# EAGLE design atx4vc (EAGLE 9.6.1)
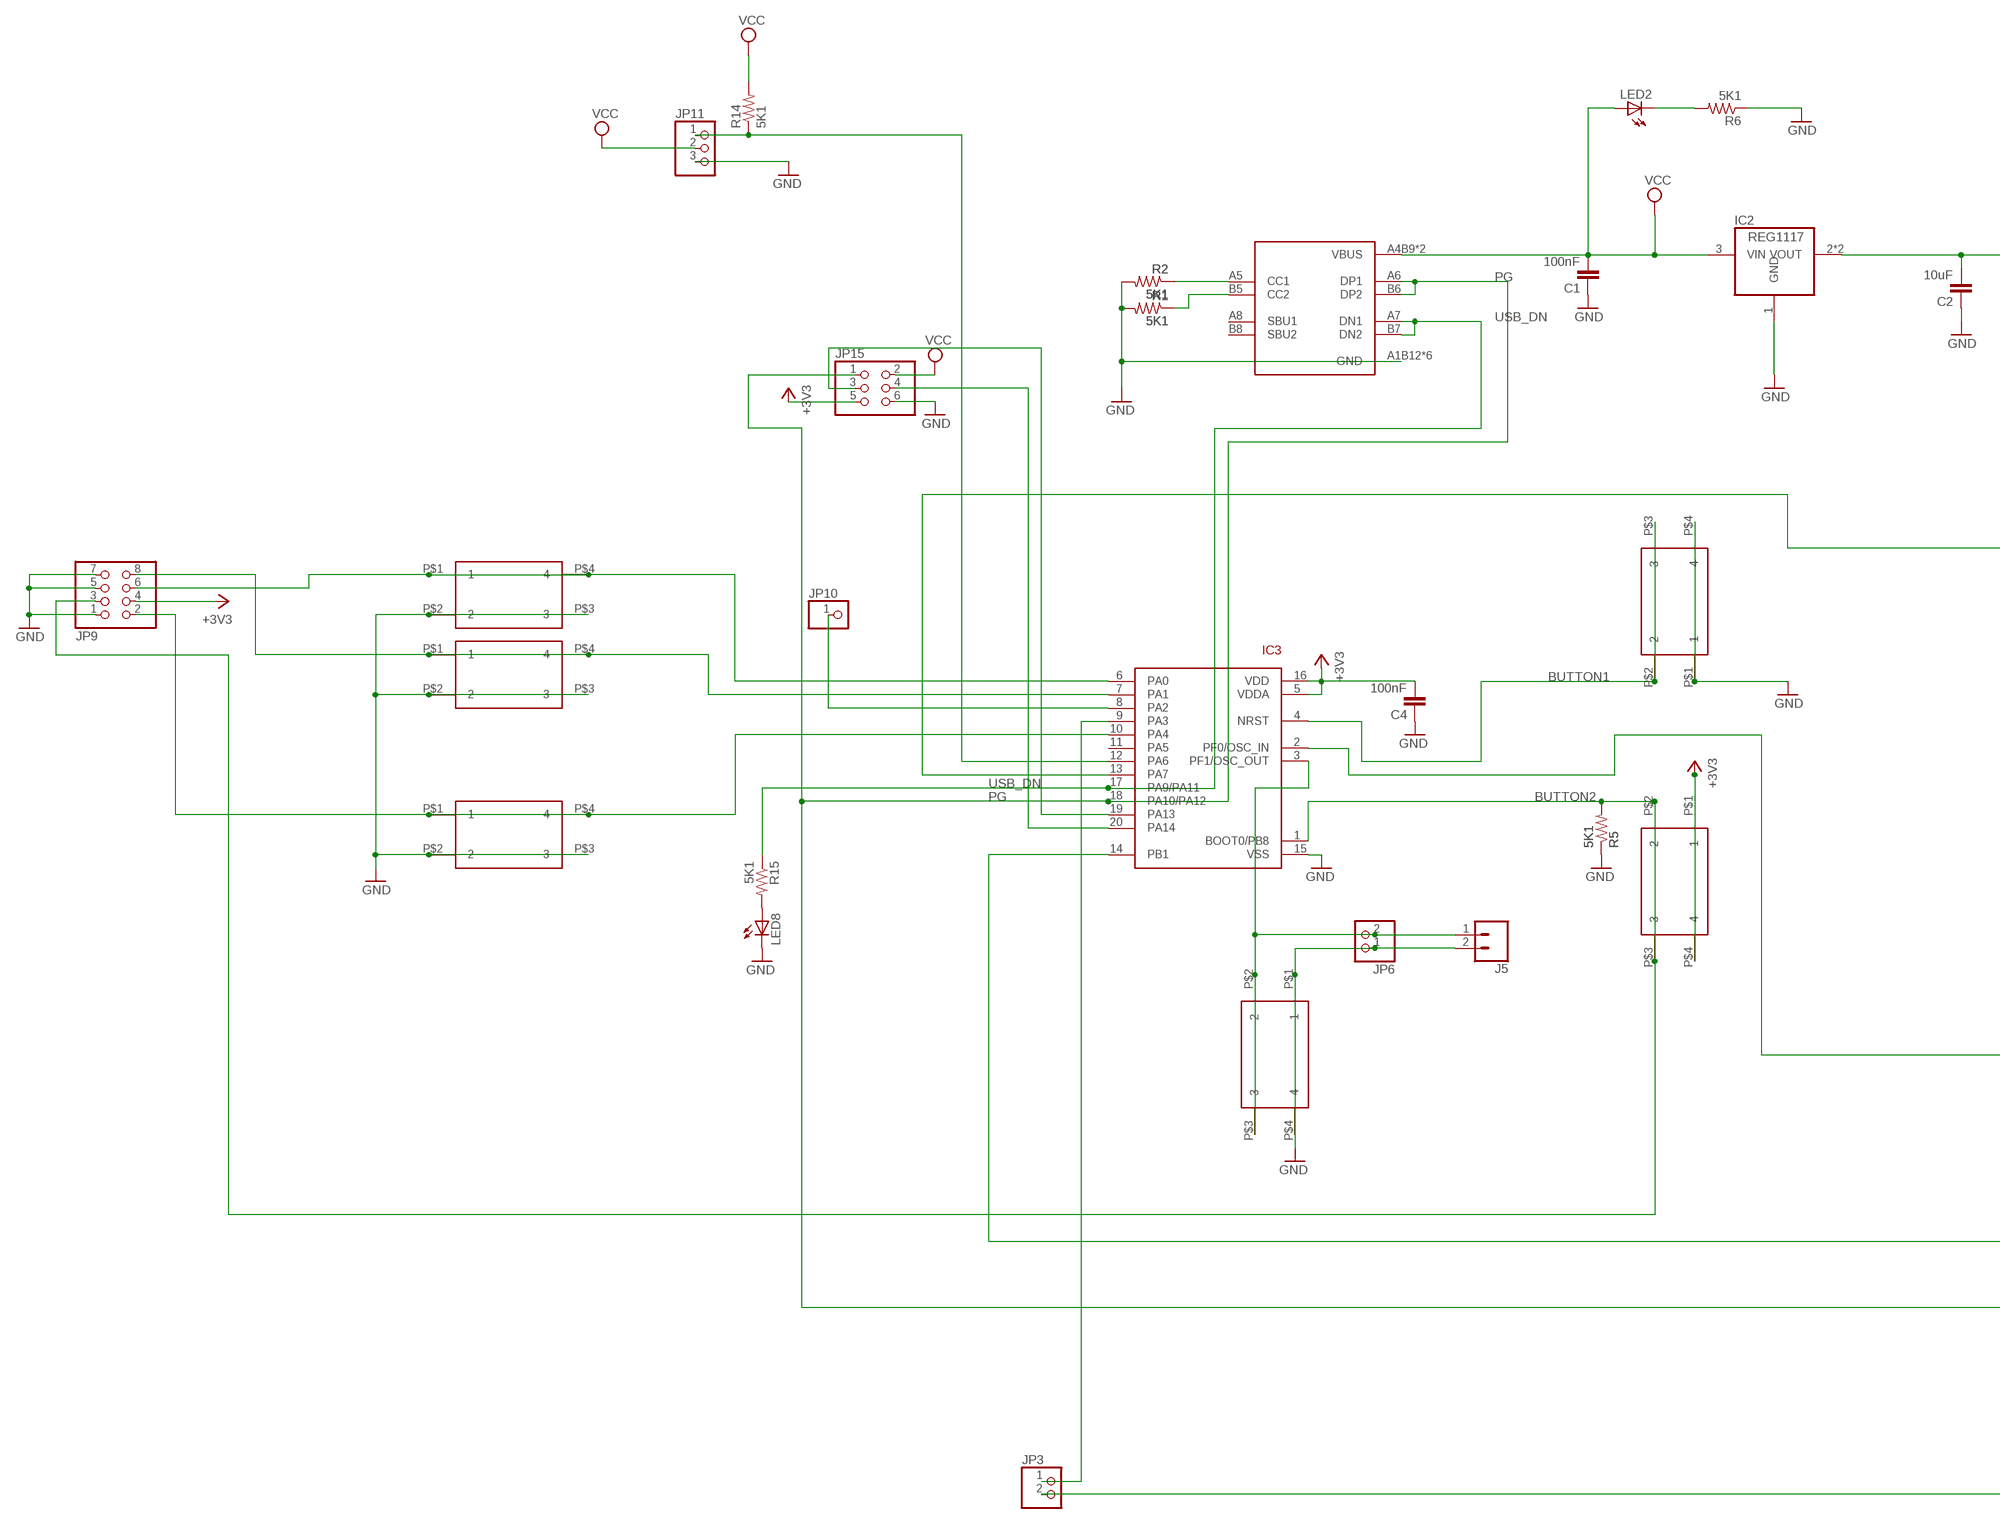
[diagram p0: schematic, sheet 1, part 1 of 2]
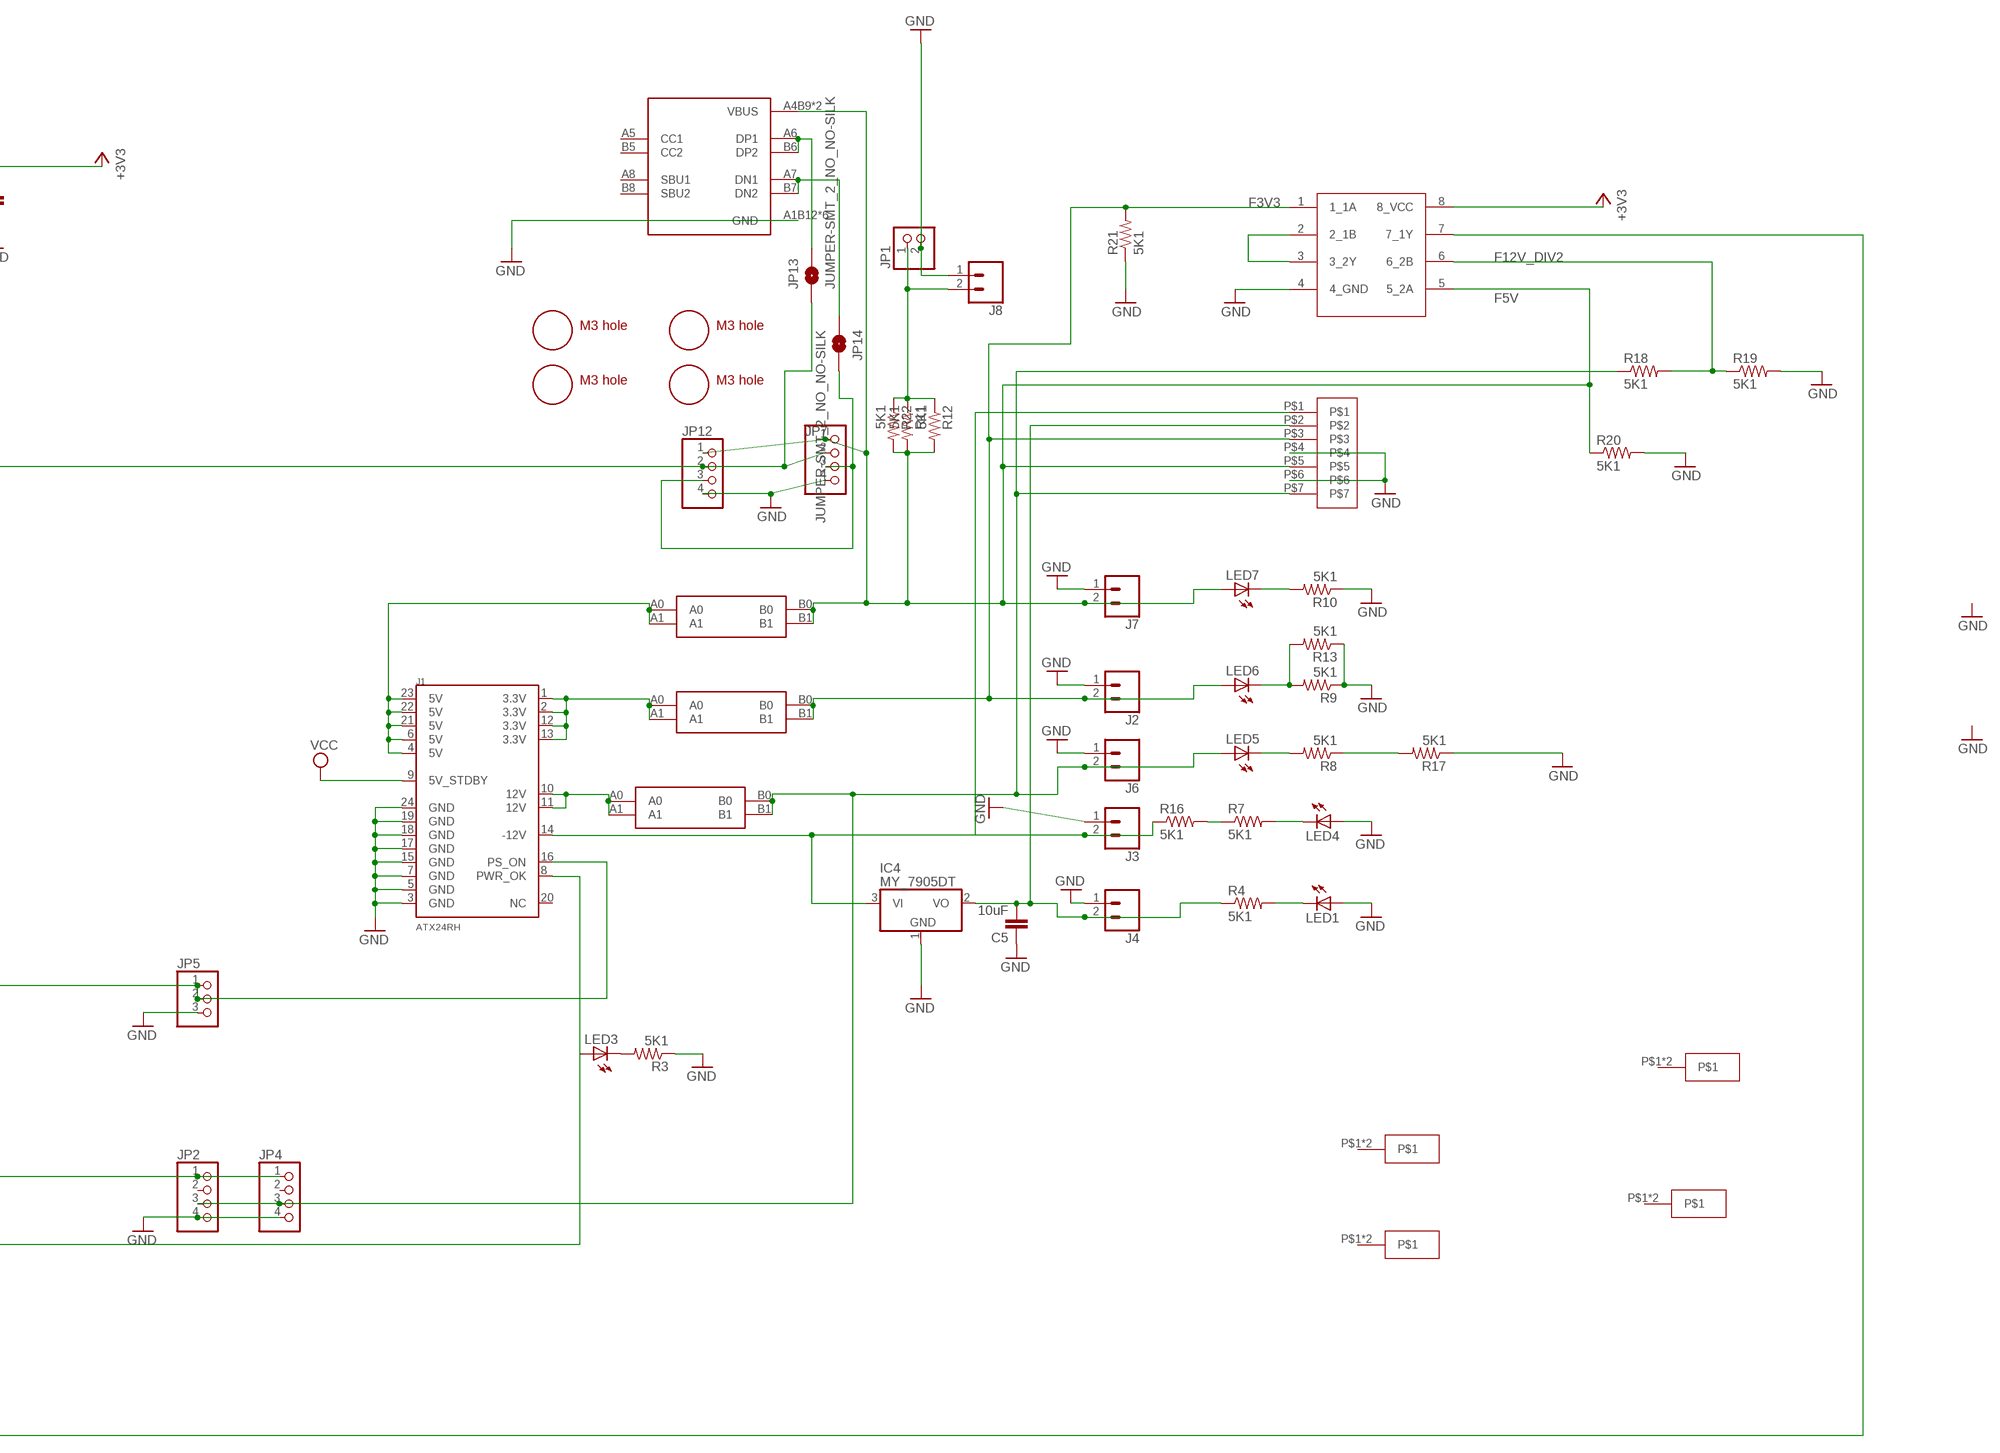
[diagram p1: schematic, sheet 1, part 2 of 2]

## Parts
C1  100nF  CAP0805  [0805$1]
C2  10uF  CAP0805  [0805$1]
C4  100nF  CAP0805  [0805$1]
C5  10uF  CAP0805  [0805$1]
IC2  REG1117  [SOT223]
IC3  STM32F042F4  [TSSOP20]
IC4  MY_7905DT  [ADAFRUIT_TO252]
J1  ATX24RH  [ATX24_RIGHT_ANGLE]
J2  CONN_023.5MM  [SCREWTERMINAL-3.5MM-2]
J3  CONN_023.5MM  [SCREWTERMINAL-3.5MM-2]
J4  CONN_023.5MM  [SCREWTERMINAL-3.5MM-2]
J5  CONN_023.5MM  [SCREWTERMINAL-3.5MM-2]
J6  CONN_023.5MM  [SCREWTERMINAL-3.5MM-2]
J7  CONN_023.5MM-NO_SILK  [SCREWTERMINAL-3.5MM-2-NS]
J8  CONN_023.5MM  [SCREWTERMINAL-3.5MM-2]
JP1  PINHD-1X2  [1X02]
JP2  PINHD-1X4  [1X04]
JP3  PINHD-1X2  [1X02]
JP4  PINHD-1X4  [1X04]
JP5  PINHD-1X3:1  [1X03]
JP6  PINHD-1X2  [1X02]
JP7  PINHD-1X6  [1X06]
JP9  PINHD-2X4  [2X04]
JP10  PINHD-1X1CB  [1X01-CLEANBIG]
JP11  PINHD-1X3CB  [1X03-CLEANBIG]
JP12  PINHD-1X6  [1X06]
JP13  JUMPER-SMT_2_NO_NO-SILK  [SMT-JUMPER_2_NO_NO-SILK]
JP14  JUMPER-SMT_2_NO_NO-SILK  [SMT-JUMPER_2_NO_NO-SILK]
JP15  PINHD-2X3  [2X03]
LED1  LEDCHIP-LED0805  [CHIP-LED0805]
LED2  LEDCHIP-LED0805  [CHIP-LED0805]
LED3  LEDCHIP-LED0805  [CHIP-LED0805]
LED4  LEDCHIP-LED0805  [CHIP-LED0805]
LED5  LEDCHIP-LED0805  [CHIP-LED0805]
LED6  LEDCHIP-LED0805  [CHIP-LED0805]
LED7  LEDCHIP-LED0805  [CHIP-LED0805]
LED8  LEDCHIP-LED0805  [CHIP-LED0805]
R1  5K1  RESISTOR0805-RES  [0805]
R2  5K1  RESISTOR0805-RES  [0805]
R3  5K1  RESISTOR0805-RES  [0805]
R4  5K1  RESISTOR0805-RES  [0805]
R5  5K1  RESISTOR0805-RES  [0805]
R6  5K1  RESISTOR0805-RES  [0805]
R7  5K1  RESISTOR0805-RES  [0805]
R8  5K1  RESISTOR0805-RES  [0805]
R9  5K1  RESISTOR0805-RES  [0805]
R10  5K1  RESISTOR0805-RES  [0805]
R11  5K1  RESISTOR0805-RES  [0805]
R12  5K1  RESISTOR0805-RES  [0805]
R13  5K1  RESISTOR0805-RES  [0805]
R14  5K1  RESISTOR0805-RES  [0805]
R15  5K1  RESISTOR0805-RES  [0805]
R16  5K1  RESISTOR0805-RES  [0805]
R17  5K1  RESISTOR0805-RES  [0805]
R18  5K1  RESISTOR0805-RES  [0805]
R19  5K1  RESISTOR0805-RES  [0805]
R20  5K1  RESISTOR0805-RES  [0805]
R21  5K1  RESISTOR0805-RES  [0805]
R22  5K1  RESISTOR0805-RES  [0805]
SW1  324_SW  [342_SWICH_FOOT]
SW2  324_SW  [342_SWICH_FOOT]
SW3  324_SW  [342_SWICH_FOOT]
SW4  324_SW  [342_SWICH_FOOT]
SW5  324_SW  [342_SWICH_FOOT]
SW7  324_SW  [342_SWICH_FOOT]
U1  USBC_16P  [USBC_16P_FOOT]
U2  USBC_16P  [USBC_16P_FOOT]
U$1  M3_MOUNTING_HOLE  [M3_MOUNTING_HOLE_PACK]
U$2  M3_MOUNTING_HOLE  [M3_MOUNTING_HOLE_PACK]
U$3  M3_MOUNTING_HOLE  [M3_MOUNTING_HOLE_PACK]
U$4  VH396  [396_7P]
U$5  CAR_FUSE_HOLDER3IN1  [FUSE_HOLDER_3IN1]
U$6  74LVC2G08  [VSSOP08]
U$7  CAR_FUSE_HOLDER3IN1  [FUSE_HOLDER_3IN1]
U$8  CAR_FUSE_HOLDER3IN1  [FUSE_HOLDER_3IN1]
U$9  WAGO257  [WAGL257]
U$10  M3_MOUNTING_HOLE  [M3_MOUNTING_HOLE_PACK]
U$11  WAGO257  [WAGL257]
U$12  WAGO257  [WAGL257]
U$13  WAGO257  [WAGL257]

## Nets
+3V3: C2.2 C4.2 IC2.2(VOUT) IC2.4(VOUT) IC3.5(VDDA) IC3.16(VDD) JP9.4 JP15.5 SW4.P$1 SW4.P$4 U$6.8(8_VCC)
BUTTON1: IC3.4(NRST) SW3.P$2 SW3.P$3
BUTTON2: IC3.1(BOOT0/PB8) JP9.3 R5.2 SW4.P$2 SW4.P$3
F3V3: J2.2 LED6.A R21.2 U$4.P$3 U$6.1(1_1A) U$7.B0 U$7.B1
F5V: J7.2 JP7.1 JP12.1 LED7.A R11.2 R12.2 R20.1 R22.2 U1.A4B9(VBUS) U1.B4A9(VBUS) U$4.P$5 U$6.5(5_2A) U$8.B0 U$8.B1
F12V: J6.2 JP2.3 JP4.3 LED5.A R18.1 U$4.P$7 U$5.B0 U$5.B1
F12V_DIV2: R18.2 R19.1 U$6.6(6_2B)
GND: C1.1 C2.1 C4.1 C5.1 IC2.1(GND) IC3.15(VSS) IC4.1(GND) J1.3(GND) J1.5(GND) J1.7(GND) J1.15(GND) J1.17(GND) J1.18(GND) J1.19(GND) J1.24(GND) J2.1 J3.1 J4.1 J5.2 J6.1 J7.1 J8.1 JP1.2 JP2.4 JP4.4 JP5.3 JP6.1 JP7.4 JP9.1 JP9.5 JP9.7 JP11.3 JP12.4 JP15.6 LED1.A LED4.A LED8.C R1.2 R2.2 R3.1 R5.1 R6.1 R9.1 R10.1 R13.1 R17.1 R19.2 R20.2 R21.1 SW1.P$1 SW1.P$4 SW2.P$2 SW2.P$3 SW3.P$1 SW3.P$4 SW5.P$2 SW5.P$3 SW7.P$2 SW7.P$3 U1.A1B12(GND) U1.B11A12(GND) U1.P$13(GND) U1.P$14(GND) U1.P$15(GND) U1.P$16(GND) U2.A1B12(GND) U2.B11A12(GND) U2.P$13(GND) U2.P$14(GND) U2.P$15(GND) U2.P$16(GND) U$4.P$4 U$4.P$6 U$6.4(4_GND)
N$1: LED3.C R3.2
N$2: IC4.3(VI) J1.14(-12V) J3.2 R16.1 U$4.P$1
N$3: IC3.20(PA14) JP15.4
N$4: IC3.19(PA13) JP15.3
N$5: LED1.C R4.2
N$6: IC3.12(PA6) JP11.1 R14.1
N$7: IC3.14(PB1) JP2.1 JP4.1
N$8: LED4.C R7.2
N$9: LED5.C R8.2
N$10: J1.4(5V) J1.6(5V) J1.21(5V) J1.22(5V) J1.23(5V) U$8.A0 U$8.A1
N$11: C5.2 IC4.2(VO) J4.2 R4.1 U$4.P$2
N$12: U$6.2(2_1B) U$6.3(3_2Y)
N$13: IC3.6(PA0) JP9.6 SW2.P$1 SW2.P$4
N$14: J1.1(3.3V) J1.2(3.3V) J1.12(3.3V) J1.13(3.3V) U$7.A0 U$7.A1
N$17: J8.2 JP1.1 R11.1 R12.1 R22.1
N$18: LED6.C R9.2 R13.2
N$19: LED8.A R15.2
N$20: LED7.C R10.2
N$21: J1.10(12V) J1.11(12V) U$5.A0 U$5.A1
N$22: IC3.7(PA1) JP9.8 SW5.P$1 SW5.P$4
N$23: IC3.8(PA2) JP10.1
N$24: JP3.2 U$6.7(7_1Y)
N$25: IC3.2(PF0/OSC_IN) J1.16(PS_ON) JP5.1 JP5.2
N$26: IC3.3(PF1/OSC_OUT) J5.1 JP6.2 SW1.P$2 SW1.P$3
N$27: IC3.10(PA4) JP9.2 SW7.P$1 SW7.P$4
N$28: R7.1 R16.2
N$29: LED2.C R6.2
N$31: R1.1 U2.B5(CC2)
N$32: R8.1 R17.2
N$33: R2.1 U2.A5(CC1)
N$34: JP13.2 U1.A6(DP1) U1.B6(DP2)
N$35: IC3.13(PA7) JP7.2 JP12.2 JP13.1
N$36: JP14.1 U1.A7(DN1) U1.B7(DN2)
N$37: JP7.3 JP12.3 JP14.2
N$38: IC3.9(PA3) JP3.1
PG: IC3.18(PA10/PA12) J1.8(PWR_OK) JP15.1 LED3.A U2.A6(DP1) U2.B6(DP2)
USB_DN: IC3.17(PA9/PA11) R15.1 U2.A7(DN1) U2.B7(DN2)
VCC: C1.2 IC2.3(VIN) J1.9(5V_STDBY) JP11.2 JP15.2 LED2.A R14.2 U2.A4B9(VBUS) U2.B4A9(VBUS)
Unconnected: IC3.11(PA5) J1.20(NC) JP2.2 JP4.2 U1.A5(CC1) U1.A8(SBU1) U1.B5(CC2) U1.B8(SBU2) U2.A8(SBU1) U2.B8(SBU2) U$9.P$1 U$9.P$2 U$11.P$1 U$11.P$2 U$12.P$1 U$12.P$2 U$13.P$1 U$13.P$2

## Library data of the parts
C1 C2 C4 C5 = atx_power_control:CAP: Capacitor Standard 0603 ceramic capacitor, and 0.1" leaded capacitor.
IC2 = atx_power_control:REG1117: 800mA and 1A Low Dropout (LDO) Positive Regulator 1.8V, 2.5V, 2.85V, 3.3V, 5V, and Adj; MF: TEXAS INSTRUMENTS; MPN: REG1117FAKTTT; OC_FARNELL: 1296120; OC_NEWARK: 87H2562
IC3 = tx:STM32F042F4
IC4 = atx_power_control:MY_7905: Positive VOLTAGE REGULATOR Added bigger pads to the TO-92 package
J1 = SparkFun-Connectors:ATX24: ATX24 Pin Power Supply Connector This is a good connector for connecting a computer power supply to a PCB. It's massive, but provides many amps of power at 5V and 12V. SKU: PRT-09498
J2-J6 J8 = atx_power_control:CONN_02: Multi connection point. Often used as Generic Header-pin footprint for 0.1 inch spaced/style header connections On any of the 0.1 inch spaced packages, you can populate with these: Break Away Headers - Straight <https://www.sparkfun.com/products/116> (PRT-00116) Break Away Male Headers - Right Angle <https://www.sparkfun.com/products/553> (PRT-00553) Female Headers <https://www.sparkfun.com/products/115> (PRT-00115) Break Away Headers - Machine Pin <https://www.sparkfun.com/products/117> (PRT-00117) Break Away Female Headers - Swiss Machine Pin <https://www.sparkfun.com/products/743> (PRT-00743) For SCREWTERMINALS and SPRING TERMINALS visit here: Screw Terimnals on SparkFun.com <https://www.sparkfun.com/search/results?term=Screw+Terminals> (5mm/3.5mm/2.54mm spacing) This device is also useful as a general connection point to wire up your design to another part of your project. Our various solder wires solder well into these plated through hole pads. Hook-Up Wire - Assortment (Stranded, 22 AWG) <https://www.sparkfun.com/products/11375> (PRT-11375) Hook-Up Wire - Assortment (Solid Core, 22 AWG) <https://www.sparkfun.com/products/11367> (PRT-11367) View the entire wire category on our website here <https://www.sparkfun.com/categories/141> Special notes: Molex polarized connector foot print use with: PRT-08233 with associated crimp pins and housings. 2.54_SCREWTERM for use with PRT-10571. 3.5mm Screw Terminal footprints for PRT-08084 5mm Screw Terminal footprints for use with PRT-08432; PROD_ID: CONN-08399
J7 = atx_power_control:CONN_02: Multi connection point. Often used as Generic Header-pin footprint for 0.1 inch spaced/style header connections On any of the 0.1 inch spaced packages, you can populate with these: Break Away Headers - Straight <https://www.sparkfun.com/products/116> (PRT-00116) Break Away Male Headers - Right Angle <https://www.sparkfun.com/products/553> (PRT-00553) Female Headers <https://www.sparkfun.com/products/115> (PRT-00115) Break Away Headers - Machine Pin <https://www.sparkfun.com/products/117> (PRT-00117) Break Away Female Headers - Swiss Machine Pin <https://www.sparkfun.com/products/743> (PRT-00743) For SCREWTERMINALS and SPRING TERMINALS visit here: Screw Terimnals on SparkFun.com <https://www.sparkfun.com/search/results?term=Screw+Terminals> (5mm/3.5mm/2.54mm spacing) This device is also useful as a general connection point to wire up your design to another part of your project. Our various solder wires solder well into these plated through hole pads. Hook-Up Wire - Assortment (Stranded, 22 AWG) <https://www.sparkfun.com/products/11375> (PRT-11375) Hook-Up Wire - Assortment (Solid Core, 22 AWG) <https://www.sparkfun.com/products/11367> (PRT-11367) View the entire wire category on our website here <https://www.sparkfun.com/categories/141> Special notes: Molex polarized connector foot print use with: PRT-08233 with associated crimp pins and housings. 2.54_SCREWTERM for use with PRT-10571. 3.5mm Screw Terminal footprints for PRT-08084 5mm Screw Terminal footprints for use with PRT-08432; PROD_ID: CONN-13512; SF_ID: PRT-09918; SF_SKU: PRT-08432; SKU: PRT-09914
JP1 JP3 = pinhead:PINHD-1X2: PIN HEADER
JP2 JP4 = atx_power_control:PINHD-1X4: PIN HEADER
JP5 = atx_power_control:PINHD-1X3*?:1: PIN HEADER
JP6 = atx_power_control:PINHD-1X2: PIN HEADER
JP7 JP12 = atx_power_control:PINHD-1X6: PIN HEADER
JP9 = atx_power_control:PINHD-2X4: PIN HEADER
JP10 = adafruit:PINHD-1X1: Pin header 1x1 for 0.1" spacing With round pins
JP11 = atx_power_control:PINHD-1X3: PIN HEADER
JP13 JP14 = SparkFun-Jumpers:JUMPER-SMT_2_NO: Normally open jumper This jumper has two pads in close proximity to each other. Apply solder to close the connection. Round pads are easier to solder for beginners, but are a lot larger. SparkFun Product that uses the round pads: SparkFun EL Sequencer <https://www.sparkfun.com/products/12781>
JP15 = pinhead:PINHD-2X3: PIN HEADER
LED1-LED8 = adafruit:LED: LED OSRAM: - CHIPLED LG R971, LG N971, LY N971, LG Q971, LY Q971, LO R971, LY R971 LH N974, LH R974 LS Q976, LO Q976, LY Q976 LO Q996 - Hyper CHIPLED LW Q18S LB Q993, LB Q99A, LB R99A - SideLED LS A670, LO A670, LY A670, LG A670, LP A670 LB A673, LV A673, LT A673, LW A673 LH A674 LY A675 LS A676, LA A676, LO A676, LY A676, LW A676 LS A679, LY A679, LG A679 - Hyper Micro SIDELED® LS Y876, LA Y876, LO Y876, LY Y876 LT Y87S - SmartLED LW L88C, LW L88S LB L89C, LB L89S, LG L890 LS L89K, LO L89K, LY L89K LS L896, LA L896, LO L896, LY L896 - TOPLED LS T670, LO T670, LY T670, LG T670, LP T670 LSG T670, LSP T670, LSY T670, LOP T670, LYG T670 LG T671, LOG T671, LSG T671 LB T673, LV T673, LT T673, LW T673 LH T674 LS T676, LA T676, LO T676, LY T676, LB T676, LH T676, LSB T676, LW T676 LB T67C, LV T67C, LT T67C, LS T67K, LO T67K, LY T67K, LW E67C LS E67B, LA E67B, LO E67B, LY E67B, LB E67C, LV E67C, LT E67C LW T67C LS T679, LY T679, LG T679 LS T770, LO T770, LY T770, LG T770, LP T770 LB T773, LV T773, LT T773, LW T773 LH T774 LS E675, LA E675, LY E675, LS T675 LS T776, LA T776, LO T776, LY T776, LB T776 LHGB T686 LT T68C, LB T68C - Hyper Mini TOPLED® LB M676 - Mini TOPLED Santana® LG M470 LS M47K, LO M47K, LY M47K Source: http://www.osram.convergy.de/
R1-R3 R5 R6 R8-R15 R17-R22 = atx_power_control:RESISTOR: Resistor Basic schematic elements and footprints for 0603, 1206, and PTH resistors.
R4 R7 R16 = SparkFun-Passives:RESISTOR: Resistor Basic schematic elements and footprints for 0603, 1206, and PTH resistors.
SW1-SW5 SW7 = 3pos_slide_switch_centered:324_SW
U1 U2 = my_usbc_16p:USBC_16P
U$1-U$3 U$10 = a:M3_MOUNTING_HOLE
U$4 = 396_conn:VH396
U$5 U$7 U$8 = atx_power_control:CAR_FUSE_HOLDER
U$6 = atx4vc:74LVC2G08
U$9 U$11-U$13 = atx4vc:WAGO257

## Board
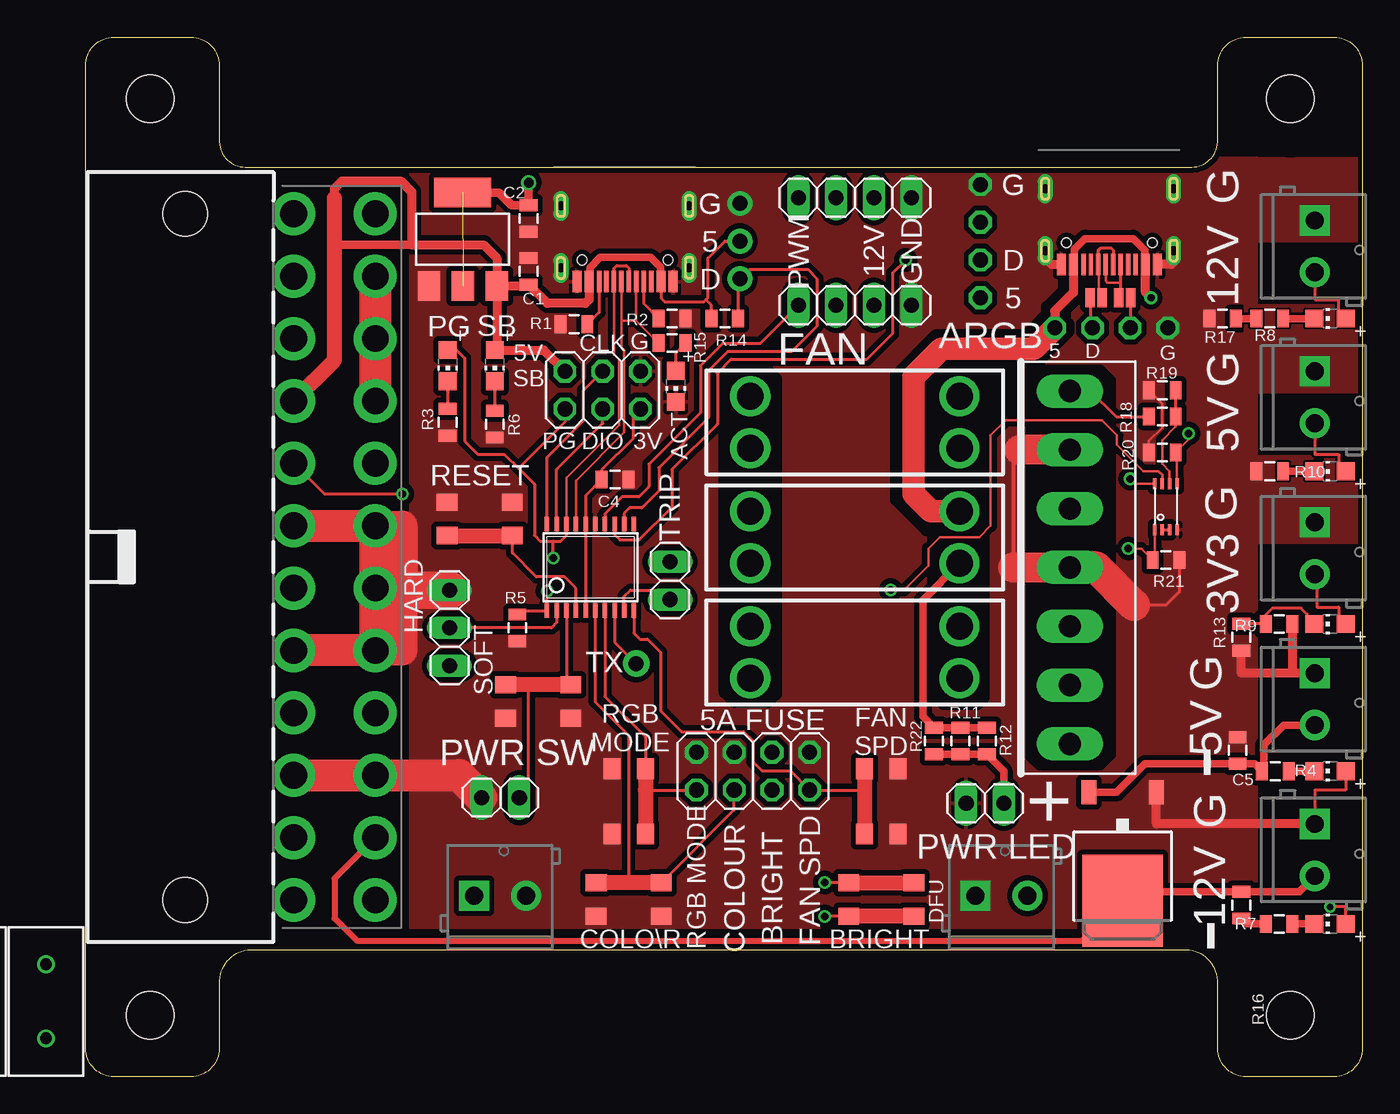
[diagram p2: board, top side]
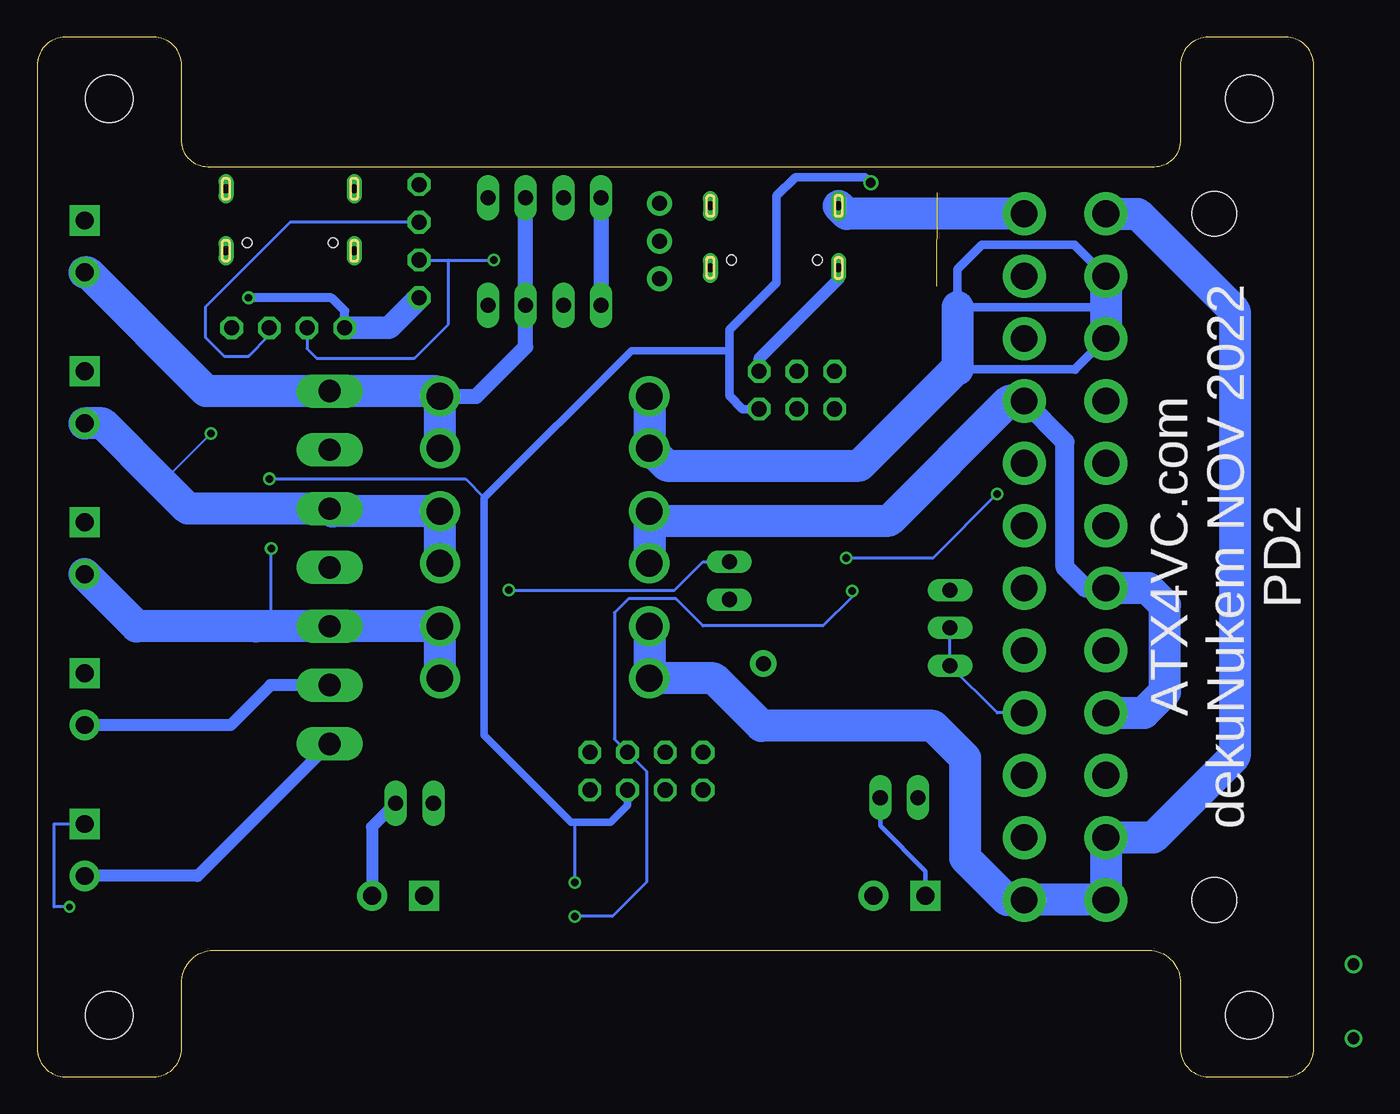
[diagram p3: board, bottom side, seen from below]

Size 86 x 70 mm. Coordinates in mm from the lower left corner, seen from the top.
Outline: 76.25,1.91 76.25,6.09 arc90 74.35,8.51 10.9,8.51 arc90 9,6.09 9,1.91 arc-90 7.09,0 1.91,0 arc-90 0,1.91 0,68.09 arc-90 1.91,70 7.09,70 arc-90 9,68.09 9,62.91 arc90 10.9,61.25 74.35,61.25 arc90 76.25,62.91 76.25,68.09 arc-90 78.16,70 84.09,70 arc-90 86,68.09 86,1.91 arc-90 84.09,0 78.16,0 arc-90 76.25,1.91
Copper layers (1*16): Top 0.035mm / dielectric 1.5mm / Bottom 0.035mm
Design rules "deku_2layer_6mil": minimum track width 6mil, minimum drill 15mil, track to track 6mil, track to pad 6mil, pad to pad 6mil, via to via 6mil, smd to smd 6mil, copper to edge 10mil, drill to drill 6mil, minimum pad ring 7mil, minimum via ring 7mil, stop-mask expansion 4mil, vias tented up to drill 25mil, thermal gap 10mil
tRestrict: area 0.3,0.2 to 8.3,8.2; area 0.3,61.8 to 8.3,69.8; area 77.2,61.9 to 85.2,69.9; area 77.2,0.2 to 85.2,8.2; area 43.1,25.3 to 46.5,47.5; area 57.1,25.1 to 60.5,47.5; area 63.8,21.1 to 69,47.5; area 54.6,36.8 to 67.1,54.9
bRestrict: area 0.3,0.2 to 8.3,8.2; area 77.2,0.2 to 85.2,8.2; area 0.3,61.8 to 8.3,69.8; area 77.2,61.9 to 85.2,69.9

### Footprints (pad centres in the part's own frame; a part is rotated, then mirrored left to right if it is on the bottom)
0805$1 = smd 0.8 x 1.2: 1 -0.9,0; 2 0.9,0
SOT223 = smd 1.499 x 2.007: 1 -2.261,-3.15; 2 0.025,-3.15; 3 2.311,-3.15 | smd 3.81 x 2.007: 4 0,3.15
TSSOP20 = smd 0.305 x 0.991: 1 -2.925,-2.918; 2 -2.275,-2.918; 3 -1.625,-2.918; 4 -0.975,-2.918; 5 -0.325,-2.918; 6 0.325,-2.918; 7 0.975,-2.918; 8 1.625,-2.918; 9 2.275,-2.918; 10 2.925,-2.918; 11 2.925,2.918; 12 2.275,2.918; 13 1.625,2.918; 14 0.975,2.918; 15 0.325,2.918; 16 -0.325,2.918; 17 -0.975,2.918; 18 -1.625,2.918; 19 -2.275,2.918; 20 -2.925,2.918
ADAFRUIT_TO252 = smd 1 x 1.6: 1 -2.28,-4.8; 2 2.28,-4.8 | smd 5.4 x 6.2: 3 0,2.5
ATX24_RIGHT_ANGLE = drill 1.8 pad 2.9: 1 23.1,4.76; 2 18.9,4.76; 3 14.7,4.76; 4 10.5,4.76; 5 6.3,4.76; 6 2.1,4.76; 7 -2.1,4.76; 8 -6.3,4.76; 9 -10.5,4.76; 10 -14.7,4.76; 11 -18.9,4.76; 12 -23.1,4.76; 13 23.1,10.26; 14 18.9,10.26; 15 14.7,10.26; 16 10.5,10.26; 17 6.3,10.26; 18 2.1,10.26; 19 -2.1,10.26; 20 -6.3,10.26; 21 -10.5,10.26; 22 -14.7,10.26; 23 -18.9,10.26; 24 -23.1,10.26 | hole 3: -23.1,-2.54; 23.1,-2.54
SCREWTERMINAL-3.5MM-2 = drill 1.2 pad 2.032 square: 1 0,0 | drill 1.2 pad 2.032: 2 3.5,0
SCREWTERMINAL-3.5MM-2-NS = drill 1.2 pad 2.032 square: 1 0,0 | drill 1.2 pad 2.032: 2 3.5,0
1X02 = drill 1.016 long: 1 -1.27,0; 2 1.27,0
1X04 = drill 1.016 long: 1 -3.81,0; 2 -1.27,0; 3 1.27,0; 4 3.81,0
1X03 = drill 1.016 long: 1 -2.54,0; 2 0,0; 3 2.54,0
1X06 = drill 1.016 octagon: 1 -6.35,0; 2 -3.81,0; 3 -1.27,0; 4 1.27,0
2X04 = drill 1.016 octagon: 1 -3.81,-1.27; 2 -3.81,1.27; 3 -1.27,-1.27; 4 -1.27,1.27; 5 1.27,-1.27; 6 1.27,1.27; 7 3.81,-1.27; 8 3.81,1.27
1X01-CLEANBIG = drill 1.016 pad 1.778: 1 0,0
1X03-CLEANBIG = drill 1.016 pad 1.676: 1 -2.54,0; 2 0,0; 3 2.54,0
SMT-JUMPER_2_NO_NO-SILK = smd 0.635 x 1.27: 1 -0.406,0; 2 0.406,0
2X03 = drill 1.016 octagon: 1 -2.54,-1.27; 2 -2.54,1.27; 3 0,-1.27; 4 0,1.27; 5 2.54,-1.27; 6 2.54,1.27
CHIP-LED0805 = smd 1.2 x 1.2: A 0,-1.05; C 0,1.05
0805 = smd 0.8 x 1.2: 1 -0.9,0; 2 0.9,0
342_SWICH_FOOT = smd 1.4 x 1.15: P$1 -2.2,-1.125; P$2 -2.2,1.125; P$3 2.2,1.125; P$4 2.2,-1.125
USBC_16P_FOOT = smd 0.6 x 1.45: A1B12 -3.225,3.848; A4B9 -2.425,3.848; B4A9 2.425,3.848; B11A12 3.225,3.848 | smd 0.3 x 1.45: A5 -1.25,3.848; A6 -0.25,3.848; A7 0.25,3.848; A8 1.25,3.848; B5 1.75,3.848; B6 0.75,3.848; B7 -0.75,3.848; B8 -1.75,3.848 | drill 0.6 pad 1 long: P$13 -4.32,2.933; P$14 4.32,2.933; P$15 -4.32,-1.248; P$16 4.32,-1.248 | hole 0.65: -2.89,2.402; 2.89,2.402
M3_MOUNTING_HOLE_PACK = hole 3.2: 0,0
396_7P = drill 1.5 long: P$1 -11.88,0; P$2 -7.92,0; P$3 -3.96,0; P$4 0,0; P$5 3.96,0; P$6 7.92,0; P$7 11.88,0
FUSE_HOLDER_3IN1 = drill 1.8: A0 -7.05,1.75; A1 -7.05,-1.75; B0 7.05,1.75; B1 7.05,-1.75
VSSOP08 = smd 0.25 x 0.75: 1 0,0; 2 0.5,0; 3 1,0; 4 1.5,0; 5 1.5,3.1; 6 1,3.1; 7 0.5,3.1; 8 0,3.1
WAGL257 = drill 0.8: P$1 0,2.5; P$2 0,-2.5

### Placement (x,y rotation side)
C1  29.84,54.23 270 top
C2  29.84,57.78 90 top
C4  35.66,40.22 180 top
C5  77.6,21.97 270 top
IC2  25.39,56.39 0 top
IC3  34.01,34.3 0 top
IC4  69.85,14.35 180 top
J1  9.25,35 270 top
J2  82.8,37.34 270 top
J3  82.8,17.02 270 top
J4  82.8,27.18 270 top
J5  26.16,12.19 0 top
J6  82.8,57.66 270 top
J7  82.8,47.5 270 top
J8  59.94,12.19 0 top
JP1  60.58,18.41 180 top
JP2  51.82,51.94 0 top
JP3  39.37,33.4 90 top
JP4  51.82,59.18 0 top
JP5  24.51,30.23 90 top
JP6  27.94,18.8 0 top
JP7  71.63,50.42 0 top
JP9  44.96,20.57 180 top
JP10  37.08,27.81 0 top
JP11  44.07,56.26 90 top
JP12  60.27,58.8 90 top
JP13  68.07,52.45 0 top
JP14  69.98,52.45 0 top
JP15  34.82,46.23 0 top
LED1  83.82,20.57 90 top
LED2  27.56,47.88 180 top
LED3  24.38,47.88 180 top
LED4  83.82,10.29 90 top
LED5  83.82,51.05 90 top
LED6  83.82,30.48 90 top
LED7  83.82,40.77 90 top
LED8  39.75,46.48 180 top
R1  32.89,50.67 180 top
R2  39.5,51.05 0 top
R3  24.38,44.07 90 top
R4  80.14,20.57 0 top
R5  29.08,30.22 90 top
R6  27.56,43.94 90 top
R7  80.39,10.29 0 top
R8  79.76,51.05 0 top
R9  80.39,30.48 180 top
R10  79.76,40.77 0 top
R11  58.93,22.61 90 top
R12  60.71,22.61 90 top
R13  77.85,29.59 90 top
R14  43.05,51.05 180 top
R15  39.5,49.4 0 top
R16  77.85,11.56 270 top
R17  76.58,51.05 0 top
R18  72.52,44.45 0 top
R19  72.52,46.23 180 top
R20  72.52,42.04 180 top
R21  72.77,34.8 180 top
R22  57.15,22.61 90 top
SW1  30.48,25.27 0 top
SW2  36.58,11.94 180 top
SW3  26.54,37.57 180 top
SW4  53.59,11.94 180 top
SW5  36.58,18.54 90 top
SW7  53.59,18.54 270 top
U1  68.96,58.55 180 top
U2  36.34,57.39 180 top
U$1  81.15,4.14 0 top
U$2  4.35,65.86 0 top
U$3  81.15,65.86 0 top
U$4  66.29,34.29 90 top
U$5  51.82,44.07 0 top
U$6  72.01,36.83 0 top
U$7  51.82,28.57 0 top
U$8  51.82,36.32 0 top
U$9  -2.67,5.08 0 top
U$10  4.35,4.14 0 top
U$11  -7.87,5.08 0 top  (outside the outline)
U$12  -13.08,5.08 0 top  (outside the outline)
U$13  -18.29,5.08 0 top  (outside the outline)

### Tracks (layer width: path | path; a pad name or v marks a point on that pad's centre or on a via)
+3V3  (via drill 0.5, 0.65)  (1 unrouted)
  Top 0.152: U$6.8 70.69,39.93 v70.36,40.26
  Top 0.203: JP15.5 36.85,44.45 36.85,42.95 34.76,40.86 C4.2 33.68,39.14 IC3.16 IC3.5 | v49.78,13.08 51.38,13.08 SW4.P$4
  Top 0.559: IC2.4 27.85,59.54 28.7,58.69 C2.2 v29.84,60.2
  Top 1.016: SW4.P$4 SW4.P$1
  Bottom 0.203: 49.78,17.14 v49.78,13.08 | v70.36,40.26 57.15,40.26 55.88,38.99
  Bottom 0.508: JP9.4 46.23,18.29 47.37,17.14 49.78,17.14 50.04,17.14 55.88,22.99 55.88,38.99 45.97,48.9 39.37,48.9
  Bottom 0.559: v29.84,60.2 30.23,60.58 34.92,60.58 36.2,59.31 36.2,53.47 39.37,50.29 39.37,48.9 39.37,45.85 38.48,44.96 JP15.5
BUTTON1
  Top 0.203: IC3.4 33.03,32.88 32.26,33.66 30.35,33.66 28.74,35.27 SW3.P$2
  Top 1.016: SW3.P$3 SW3.P$2
BUTTON2  (via drill 0.5)
  Top 0.203: R5.2 29.35,31.39 IC3.1 31.08,32.71 v31.09,32.72 | SW4.P$3 51.38,10.79 v49.78,10.79
  Top 1.016: SW4.P$2 SW4.P$3
  Bottom 0.203: v31.09,32.72 31.09,32.33 33.07,30.35 41.15,30.35 42.98,32.18 46.18,32.18 47.12,31.24 47.12,22.73 JP9.3 44.96,20.57 44.96,13.08 47.24,10.79 v49.78,10.79
F3V3  (via drill 0.5)
  Top 0.152: v70.23,35.56 71.11,35.56 R21.2 72.01,34.94 U$6.1
  Top 0.203: J2.2 82.93,33.84 82.93,31.62 84.4,31.62 84.4,30.48 LED6.A
  Bottom 0.203: 71.25,30.33 70.23,31.35 v70.23,35.56
  Bottom 2.159: U$7.B1 U$7.B0 U$4.P$3 71.25,30.33 79.3,30.33 J2.2
F5V  (via drill 0.5)
  Top 0.152: v74.3,43.31 74.3,42.91 R20.1 73.51,41.95 U$6.5
  Top 0.203: J7.2 82.8,41.91 84.4,41.91 84.4,40.77 LED7.A
  Top 0.508: U1.B4A9 66.59,54.75 66.59,55.72 67.31,56.44 70.56,56.44 71.33,55.66 71.33,54.75 U1.A4B9 | U$8.B1 56.39,32.09 56.39,24.27 R22.2 R11.2 R12.2
  Top 0.61: U1.B4A9 66.54,52.82 65.28,51.56 JP7.1 | v71.75,52.45 71.39,52.82 U1.A4B9
  Top 1.524: U$8.B0 56.92,38.07 55.75,39.24 55.75,47.12 57.66,49.02 63.88,49.02 JP7.1
  Bottom 0.152: v74.3,43.31 77.6,40.01
  Bottom 0.61: JP7.1 65.28,51.56 66.17,52.45 v71.75,52.45
  Bottom 1.524: JP7.1 62.31,50.42 JP12.1
  Bottom 2.159: U$8.B1 U$8.B0 66.12,38.07 U$4.P$5 75.84,38.25 77.6,40.01 81.59,44 J7.2
F12V
  Top 0.203: U$4.P$7 67.69,46.17 69.41,44.45 R18.1 | J6.2 82.8,52.32 84.38,52.32 84.38,51.05 LED5.A
  Bottom 1.016: U$5.B0 56.42,45.82 53.09,49.15 JP2.3 JP4.3
  Bottom 2.159: U$5.B1 U$5.B0 59.22,46.17 U$4.P$7 74.62,46.17 82.61,54.16 J6.2
F12V_DIV2
  Top 0.152: R18.2 73.42,43.75 72.52,42.85 72.52,41.27 73.01,40.78 U$6.6
  Top 0.203: R19.1 R18.2
GND  (via drill 0.45)
  Top 0.152: R19.2 72.52,45.33 72.52,43.71 71.62,42.81 R20.2
  Top 0.203: LED1.A 84.87,19.3 82.8,19.3 J3.1 | LED4.A 84.87,11.43 v83.82,11.43 | R21.1 73.67,32.65 72.77,31.75 70.61,31.75
  Top 0.254: 62.91,42.21 62.48,41.78 62.48,34.29
  Top 0.61: U1.P$14 64.64,55.12 65.06,54.7 U1.B11A12 | U1.P$13 73.28,54.87 73.11,54.7 U1.A1B12 | J4.1 81.29,27.18 | 81.29,27.18 77.85,27.18 R13.1 | R9.1 81.29,27.18 | J3.1 72.13,17.02 IC4.1
  Top 2.032: U$4.P$6 62.91,42.21 | 62.48,34.29 U$4.P$4 | J1.19 21.34,37.1 21.34,32.77 | J1.17 21.34,28.7 21.34,32
  Top 2.159: J1.3 J1.15 25.17,20.3 JP6.1 | J1.7 J1.19 J1.18 | J1.18 J1.17 J1.5 | 19.65,32.77 J1.18 | U$4.P$4 68.07,34.29 70.61,31.75
  Top 2.54: JP5.3 21.34,32.77 19.65,32.77
  Bottom 0.203: v83.82,11.43 84.86,11.43 84.86,17.02 J3.1
  Bottom 0.813: U2.P$14 32.02,53.71 37.34,48.39 37.34,47.52 JP15.6
  Bottom 2.159: J1.24 31.48,58.1 U2.P$16
  pour Top (isolate 0.356): 21.84,10.03 78.89,10.03 78.89,61.87 21.84,61.87
  pour Top (no thermals): 78.11,51.94 86.11,51.94 86.11,46.1 78.11,46.1
  pour Top (no thermals): 77.47,61.85 86.11,61.85 86.11,56.26 77.47,56.26
  pour Top (no thermals): 77.09,41.78 86.11,41.78 86.11,35.94 77.09,35.94
N$1
  Top 0.203: LED3.C R3.2
N$2
  Top 0.406: J1.14 16.76,13.35 16.76,10.67 18.29,9.14 67.14,9.14 IC4.3
  Top 0.508: J3.2 81.74,12.46 R16.1 70.46,12.46 IC4.3
  Bottom 0.813: U$4.P$1 75.19,13.52 J3.2
N$3
  Top 0.203: IC3.20 31.08,41.7 33.55,44.17 33.55,46.23 JP15.4
N$4
  Top 0.203: IC3.19 31.73,40.9 34.82,43.99 JP15.3
N$5
  Top 0.508: R4.2 LED1.C
N$6
  Top 0.203: R14.1 43.95,53.6 JP11.1 44.7,54.36 48.64,54.36 49.28,53.72 49.28,50.55 47.57,48.84 43.26,48.84 41.96,47.55 41.96,44.37 38.61,41.02 38.61,39.45 37.47,38.3 36.65,38.3 36.28,37.93 IC3.12
N$7
  Top 0.203: JP2.1 45.47,49.4 42.93,49.4 41.4,47.88 41.4,44.7 37.95,41.25 37.95,39.73 37.26,39.04 36.12,39.04 34.98,37.9 IC3.14
  Bottom 1.016: JP4.1 JP2.1
N$8
  Top 0.508: R7.2 LED4.C
N$9
  Top 0.508: LED5.C R8.2
N$10
  Top 2.159: J1.23 J1.22 J1.21
  Bottom 1.27: J1.6 15.37,32.9 16.76,34.29 16.76,42.75 J1.21
  Bottom 2.159: J1.4 11.44,24.5 10.03,25.91 10.03,31.75 11.18,32.9 J1.6 | J1.21 20.54,45.5 28.6,37.44 44.13,37.44 U$8.A0 U$8.A1
N$11
  Top 0.508: IC4.2 69.44,19.15 71.36,21.07 C5.2 78.74,21.07 R4.1 79.36,20.7 79.36,22.34 80.7,23.68 J4.2
  Bottom 0.813: U$4.P$2 70.28,26.37 72.97,23.68 J4.2
N$12
  Top 0.203: U$6.2 U$6.3
N$13
  Top 0.203: IC3.6 34.33,25.23 36.58,22.99 36.58,13.06 | SW2.P$1 43.69,17.98 JP9.6
  Top 1.016: SW2.P$1 36.58,13.06 SW2.P$4
N$14
  Bottom 2.159: J1.12 11.87,58.1 5.33,51.56 5.33,21.59 10.82,16.1 J1.2 J1.1 J1.13 20.66,11.9 23.5,14.73 23.5,21.46 25.65,23.62 37.21,23.62 40.41,26.82 U$7.A1 U$7.A0
N$17
  Top 0.508: R22.1 R11.1 R12.1 61.85,20.56 JP1.1
  Bottom 0.813: JP1.1 63.44,16.82 J8.2
N$18
  Top 0.203: LED6.C 82.26,30.99 82.26,31.15 81.86,31.55 79.93,31.55 79.49,31.1 R9.2 | R9.2 R13.2
  Top 0.508: R9.2
N$19
  Top 0.203: LED8.A 39.75,48.76 R15.2
N$20
  Top 0.508: LED7.C R10.2
N$21
  Bottom 0.559: 16.09,47.62 24,47.62 | 16.12,56.01 22.35,56.01 24,54.36 24,51.82 14.01,51.82
  Bottom 0.61: J1.11 16.12,56.01 | J1.10 16.09,47.62
  Bottom 2.159: J1.11 14.01,51.82 J1.10 | U$5.A0 U$5.A1 43.59,41.15 30.61,41.15 24,47.75 | 24,51.82 24,47.75 | 24,47.75 24,47.62
N$22
  Top 0.203: IC3.7 34.98,25.6 37.7,22.88 SW5.P$4 | 37.7,19.3 JP9.8
  Top 1.016: SW5.P$4 37.7,19.3 SW5.P$1
N$23
  Top 0.203: IC3.8 35.63,29.27 JP10.1
N$24  (via drill 0.5)
  Top 0.152: v54.23,32.77 55.12,32.77 56.77,34.42 56.77,35.56 57.53,36.32 60.2,36.32 60.96,37.08 60.96,43.18 61.98,44.2 68.45,44.2 69.47,43.18 69.47,42.55 71.25,40.77 72.26,40.77 72.51,40.52 U$6.7
  Bottom 0.203: v54.23,32.77 54.2,32.74 43.08,32.74 41.15,34.67 JP3.2
N$25
  Top 0.203: IC3.2 31.73,30.59 31.37,30.23 JP5.2
  Bottom 0.203: J1.16 21.32,24.5 JP5.1 JP5.2
N$26
  Top 0.203: IC3.3 32.38,26.7 SW1.P$3 | JP6.2 29.84,19.43 29.84,26.4
  Top 1.016: SW1.P$3 29.84,26.4 SW1.P$2
  Bottom 0.305: JP6.2 29.21,16.89 26.16,13.84 J5.1
N$27
  Top 0.203: 52.47,19.3 JP9.2 47.5,20.57 45.59,20.57 44.96,21.21 44.96,22.61 44.32,23.24 40.13,23.24 38.73,24.64 38.73,28.57 37.85,29.46 37.34,29.46 36.93,29.87 IC3.10
  Top 1.016: SW7.P$1 52.47,19.3 SW7.P$4
N$28
  Top 0.508: R16.2 78.22,10.29 R7.1
N$29
  Top 0.203: LED2.C R6.2
N$31
  Top 0.203: U2.B5 34.59,51.47 R1.1
N$32
  Top 0.508: R8.1 R17.2
N$33
  Top 0.203: U2.A5 37.59,52.06 R2.1
N$34
  Top 0.152: U1.B6 68.24,54.67 68.24,52.69 JP13.2
  Top 0.203: U1.B6 68.21,55.66 68.35,55.8 69.06,55.8 69.21,55.66 U1.A6
N$35  (via drill 0.5)
  Top 0.203: IC3.13 35.63,36.51 35.99,36.14 37.29,36.14 39.5,38.35 39.5,40.89 42.55,43.94 42.55,47.37 43.48,48.31 52.63,48.31 54.36,50.04 54.36,54.1 v55.24,54.99 | JP13.1 67.67,50.57 JP7.2
  Bottom 0.203: JP7.2 67.82,49.02 67.18,48.39 60.58,48.39 58.29,50.67 58.29,54.99 | JP12.2 58.29,54.99 | 58.29,54.99 v55.24,54.99
N$36
  Top 0.152: U1.A7 68.71,53.6 68.71,53.59 68.83,53.47 69.71,53.47
  Top 0.203: U1.B7 69.71,53.47 69.71,52.59 JP14.1
N$37
  Top 0.203: JP14.2 70.38,50.44 JP7.3
  Bottom 0.203: JP12.3 68.96,57.53 74.68,51.82 74.68,49.78 73.41,48.51 71.75,48.51 70.36,49.91 JP7.3
N$38
  Top 0.203: IC3.9 36.28,32.34 36.7,32.77 38.73,32.77 JP3.1
PG  (via drill 0.5)
  Top 0.152: U2.B6 35.59,48.62 35.92,48.28 35.92,43.87 32.38,40.33 IC3.18
  Top 0.203: U2.B6 35.59,54.43 35.76,54.61 36.42,54.61 36.59,54.45 U2.A6 | J1.8 16.07,39.24 v21.34,39.24 | 29.15,40.96 28.19,41.91 26.42,41.91 25.53,42.8 25.53,48.39 24.98,48.93 LED3.A | 29.15,40.96 30.23,39.88 30.23,36.45 30.61,36.07 31.5,36.07 | 31.5,36.07 32,36.07 32.38,36.45 IC3.18 | v31.5,34.92 31.5,36.07 | JP15.1 32.28,44.09 29.15,40.96
  Bottom 0.203: v21.34,39.24 25.65,34.92 v31.5,34.92
USB_DN
  Top 0.152: IC3.17 33.03,40.14 36.27,43.38 36.27,48.95 36.09,49.13 36.09,50.93 | U2.A7 36.09,50.93 | R15.1 37.09,50.91 | U2.B7 37.09,50.91 | 37.09,50.91 36.1,50.91 36.09,50.93
VCC
  Top 0.203: U2.A4B9 38.76,52.42 38.99,52.2 41.66,52.2 41.78,52.32 | 41.78,52.32 41.91,52.45 41.91,55.12 43.05,56.26 JP11.2 | R14.2 42.15,51.95 41.78,52.32
  Top 0.508: U2.B4A9 33.96,53.59 33.96,54.48 34.65,55.17 38.05,55.17 38.71,54.51 38.71,53.59 U2.A4B9
  Top 0.559: 21.97,56.01 16.76,56.01 | 27.7,49.07 LED2.A | C1.2 29.75,53.24
  Top 0.61: IC2.3 27.7,55.1 26.8,56.01 21.97,56.01 21.97,59.56 21.21,60.33 17.27,60.33 16.76,59.82 16.76,59.18 | IC2.3 27.7,49.07 | 29.75,53.24 IC2.3 | U2.B4A9 33.91,52.33 33.66,52.07 31.1,52.07 C1.2 | LED2.A 30.85,48.93 JP15.2
  Top 1.016: J1.9 16.76,48.25 16.76,56.01 16.76,59.18

### Text on the board
tNames: G | G | G | 5 | PWM | 12V | GND | D | 12V | D | 5 | PG | SB | G | ARGB | CLK | FAN | 5 | D | G | 5V / SB | G | 5V | PG | DIO | 3V | ACT | RESET | G | TRIP | 3V3 | HARD | SOFT | TX | G | 5A FUSE | RGB / MODE | FAN / SPD | -5V | PWR SW | + | G | PWR LED | RGB MODE | COLOUR | BRIGHT | FAN SPD | DFU | -12V | COLO\R | BRIGHT
bNames: ATX4VC.com / dekuNukem NOV 2022 / PD2